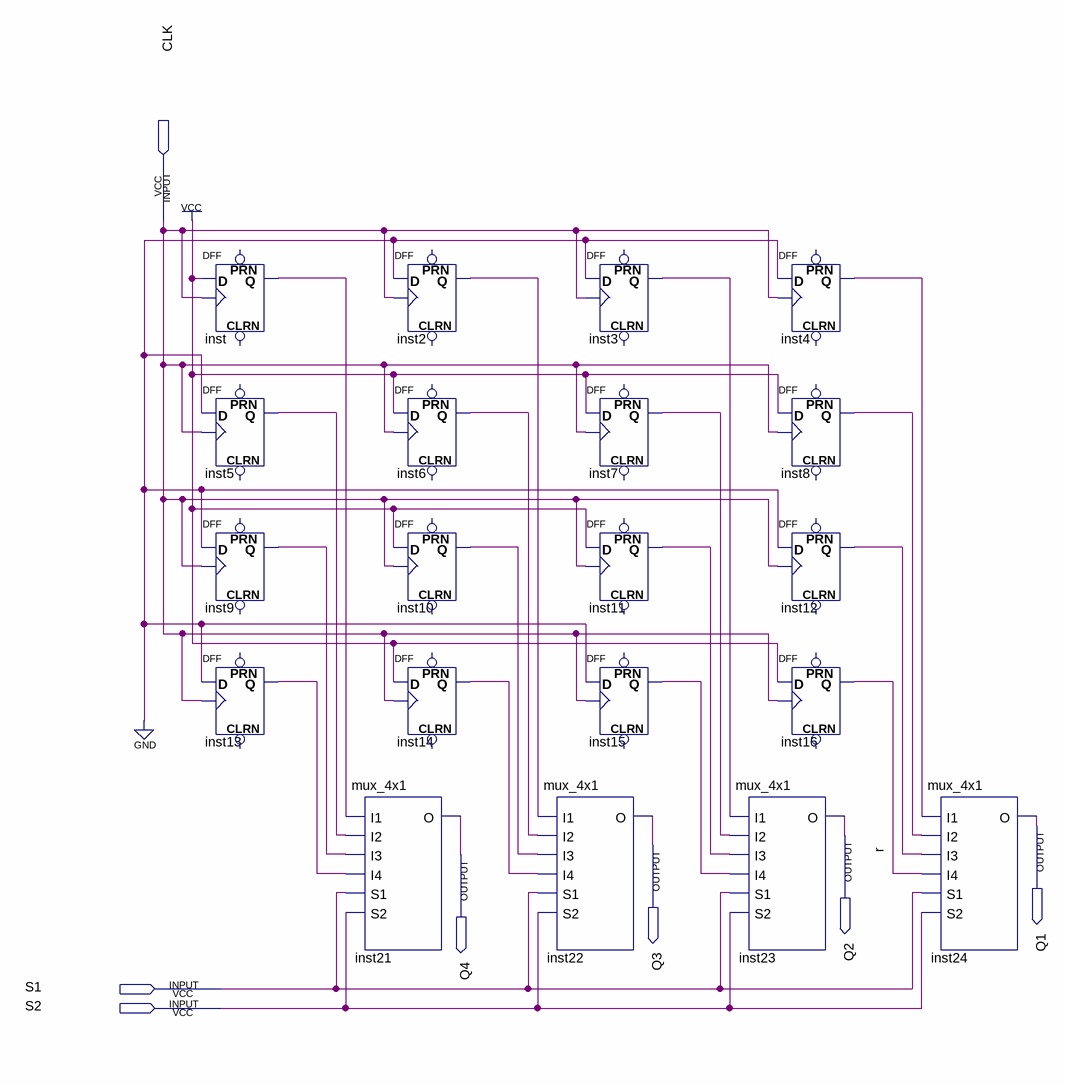
[diagram p0: schematic sheet]
// Quartus schematic 4x4_memory.bdf as structural Verilog: 20 symbols, 7 pins
module \4x4_memory  (
  input  CLK,
  input  S1,
  input  S2,
  output Q1,
  output Q2,
  output Q3,
  output Q4
);

  wire inst2_q, inst3_q, inst4_q, inst5_q, inst6_q, inst7_q, inst8_q, inst9_q, inst10_q, inst11_q, inst12_q,
       inst13_q, inst14_q, inst15_q, inst_q, r;

  DFF inst (.CLK(CLK), .D(1'b1), .Q(inst_q));  // open: CLRN, PRN
  DFF inst5 (.CLK(CLK), .D(1'b0), .Q(inst5_q));  // open: CLRN, PRN
  DFF inst9 (.CLK(CLK), .D(1'b0), .Q(inst9_q));  // open: CLRN, PRN
  DFF inst13 (.CLK(CLK), .D(1'b0), .Q(inst13_q));  // open: CLRN, PRN
  mux_4x1 inst21 (.I1(inst_q), .I2(inst5_q), .I3(inst9_q), .I4(inst13_q), .S1(S1), .S2(S2), .O(Q4));
  DFF inst2 (.CLK(CLK), .D(1'b0), .Q(inst2_q));  // open: CLRN, PRN
  DFF inst6 (.CLK(CLK), .D(1'b1), .Q(inst6_q));  // open: CLRN, PRN
  DFF inst10 (.CLK(CLK), .D(1'b1), .Q(inst10_q));  // open: CLRN, PRN
  DFF inst14 (.CLK(CLK), .D(1'b1), .Q(inst14_q));  // open: CLRN, PRN
  DFF inst3 (.CLK(CLK), .D(1'b0), .Q(inst3_q));  // open: CLRN, PRN
  DFF inst7 (.CLK(CLK), .D(1'b1), .Q(inst7_q));  // open: CLRN, PRN
  DFF inst11 (.CLK(CLK), .D(1'b1), .Q(inst11_q));  // open: CLRN, PRN
  DFF inst15 (.CLK(CLK), .D(1'b0), .Q(inst15_q));  // open: CLRN, PRN
  mux_4x1 inst22 (.I1(inst2_q), .I2(inst6_q), .I3(inst10_q), .I4(inst14_q), .S1(S1), .S2(S2), .O(Q3));
  mux_4x1 inst23 (.I1(inst3_q), .I2(inst7_q), .I3(inst11_q), .I4(inst15_q), .S1(S1), .S2(S2), .O(Q2));
  DFF inst4 (.CLK(CLK), .D(1'b0), .Q(inst4_q));  // open: CLRN, PRN
  DFF inst8 (.CLK(CLK), .D(1'b1), .Q(inst8_q));  // open: CLRN, PRN
  DFF inst12 (.CLK(CLK), .D(1'b0), .Q(inst12_q));  // open: CLRN, PRN
  DFF inst16 (.CLK(CLK), .D(1'b1), .Q(r));  // open: CLRN, PRN
  mux_4x1 inst24 (.I1(inst4_q), .I2(inst8_q), .I3(inst12_q), .I4(r), .S1(S1), .S2(S2), .O(Q1));
endmodule
